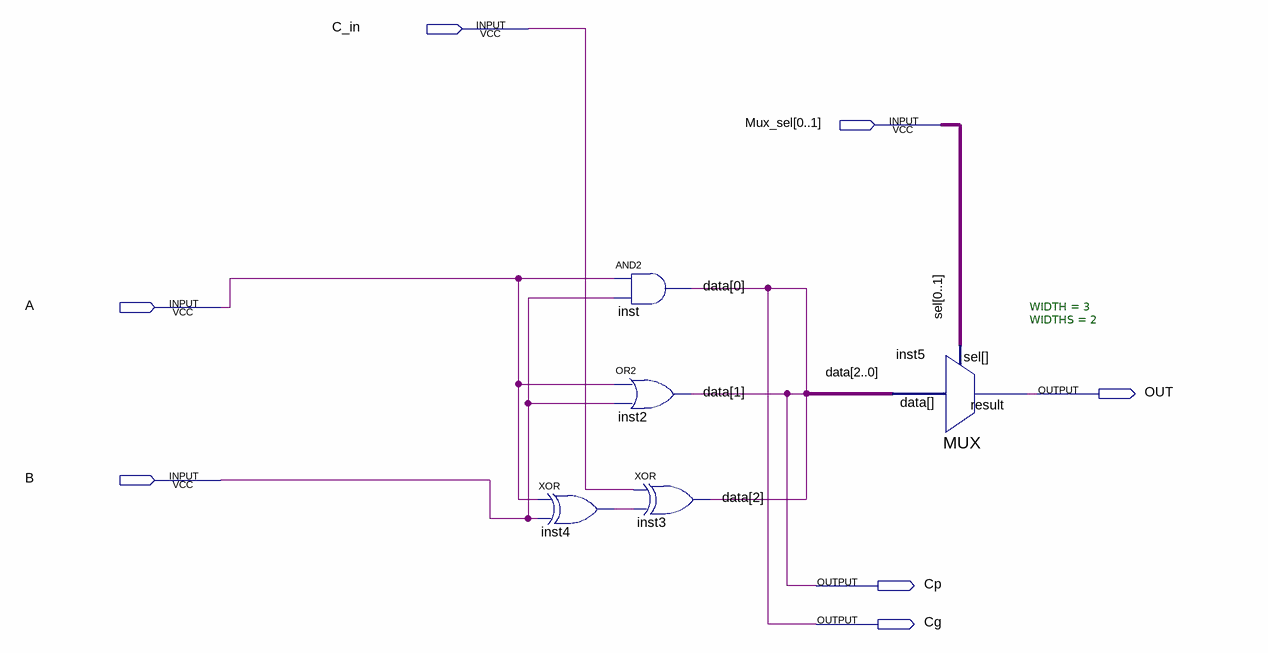
[diagram p0: schematic sheet]
// Quartus schematic Ula1bitsimples.bdf as structural Verilog: 5 symbols, 7 pins
module Ula1bitsimples (
  input  C_in,
  input  [0:1] Mux_sel,
  input  A,
  input  B,
  output OUT,
  output Cp,
  output Cg
);

  wire inst4_out;
  wire [2:2] data;

  xor inst4 (inst4_out, A, B);
  and inst (Cg, A, B);
  or inst2 (Cp, A, B);
  xor inst3 (data[2], C_in, inst4_out);
  MUX #(.WIDTH(3), .WIDTHS(2)) inst5 (.data({data[2], Cp, Cg}), .sel(Mux_sel), .result(OUT));

  // Other names for the same wires on the sheet: data[1:0] = {Cp, Cg}; sel[1:0] = {Mux_sel[1], Mux_sel[0]}
endmodule
